# Altium schematic sheet Audio_Preperation.SchDoc
size A
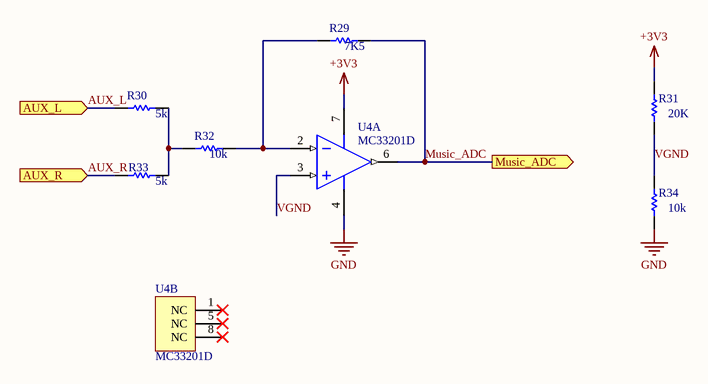
[diagram p0: Audio_Preperation.SchDoc]

## Parts
R29  7K5  [RESC0805(2012)_L]
R30  5k  [RESC0805(2012)_L]
R31  20k  [RESC0805(2012)_L]
R32  10K  [RESC0805(2012)_L]
R33  5k  [RESC0805(2012)_L]
R34  10k  [RESC0805(2012)_L]
U4  MC33201D  [ONSC-SOIC-8-751-07_V]  (parts A,B of 2)

## Ports
AUX_L (in), AUX_R (in), Music_ADC (out)

## Nets
+3V3: R31.2 U4.7(VCC)
GND: R34.1 U4.4(VEE)
AUX_L: R30.1 ; port AUX_L
AUX_R: R33.1 ; port AUX_R
Music_ADC: R29.2 U4.6(OUT) ; port Music_ADC
VGND: R31.1 R34.2 U4.3(IN+)
NetR29_1: R29.1 R32.2 U4.2(IN-)
NetR30_2: R30.2 R32.1 R33.2

Not connected (* = marked no-connect by the designer): U4 1(NC)* 5(NC)* 8(NC)*

## Library data of the parts
R29-R34 = CMP-1591-00002-1: 0805 (2012 Metric) Chip Resistor; Case-EIA: 0805; Case-Metric: 2012; PackageReference: RESC0805(2012)
  R29: Value: 7K5
  R30 R33: Value: 5k
  R31: Value: 20K
  R32 R34: Value: 10k
U4 = CMP-1310-00330-1: Low Voltage, Rail-to-Rail Operational Amplifier, 1.8 to 12 V, -40 to 105 degC, 8-Pin SOIC, Tube; Manufacturer: On Semiconductor; VCC Min (V): 1.8; SR Typ (V/uS): 1; VCC Max (V): 12; GBW Typ (MHz): 2.2; ComponentLink1Description: Manufacturer URL; Mounting Technology: Surface Mount; ComponentLink2Description: Datasheet; PackageDescription: 8-Pin Small Outline Integrated Circuit, Body 4.9 x 3.9 mm, Pitch 1.27 mm; PackageReference: SOIC-8-751-07; ComponentLink2URL: http://www.onsemi.cn/pub_link/Collateral/MC33201-D.PDF; PartNumber: MC33201D; DatasheetVersion: Rev. 17; ComponentLink3Description: Package Specification; Packing: Tube; PackageVersion: Rev. AK, 02/2011; ComponentLink3URL: http://www.onsemi.com/pub_link/Collateral/751-07.PDF; ComponentLink1URL: http://www.onsemi.com/; RoHS: FALSE; PartId: 1